# EAGLE design Front v1 (EAGLE 9.7.0)
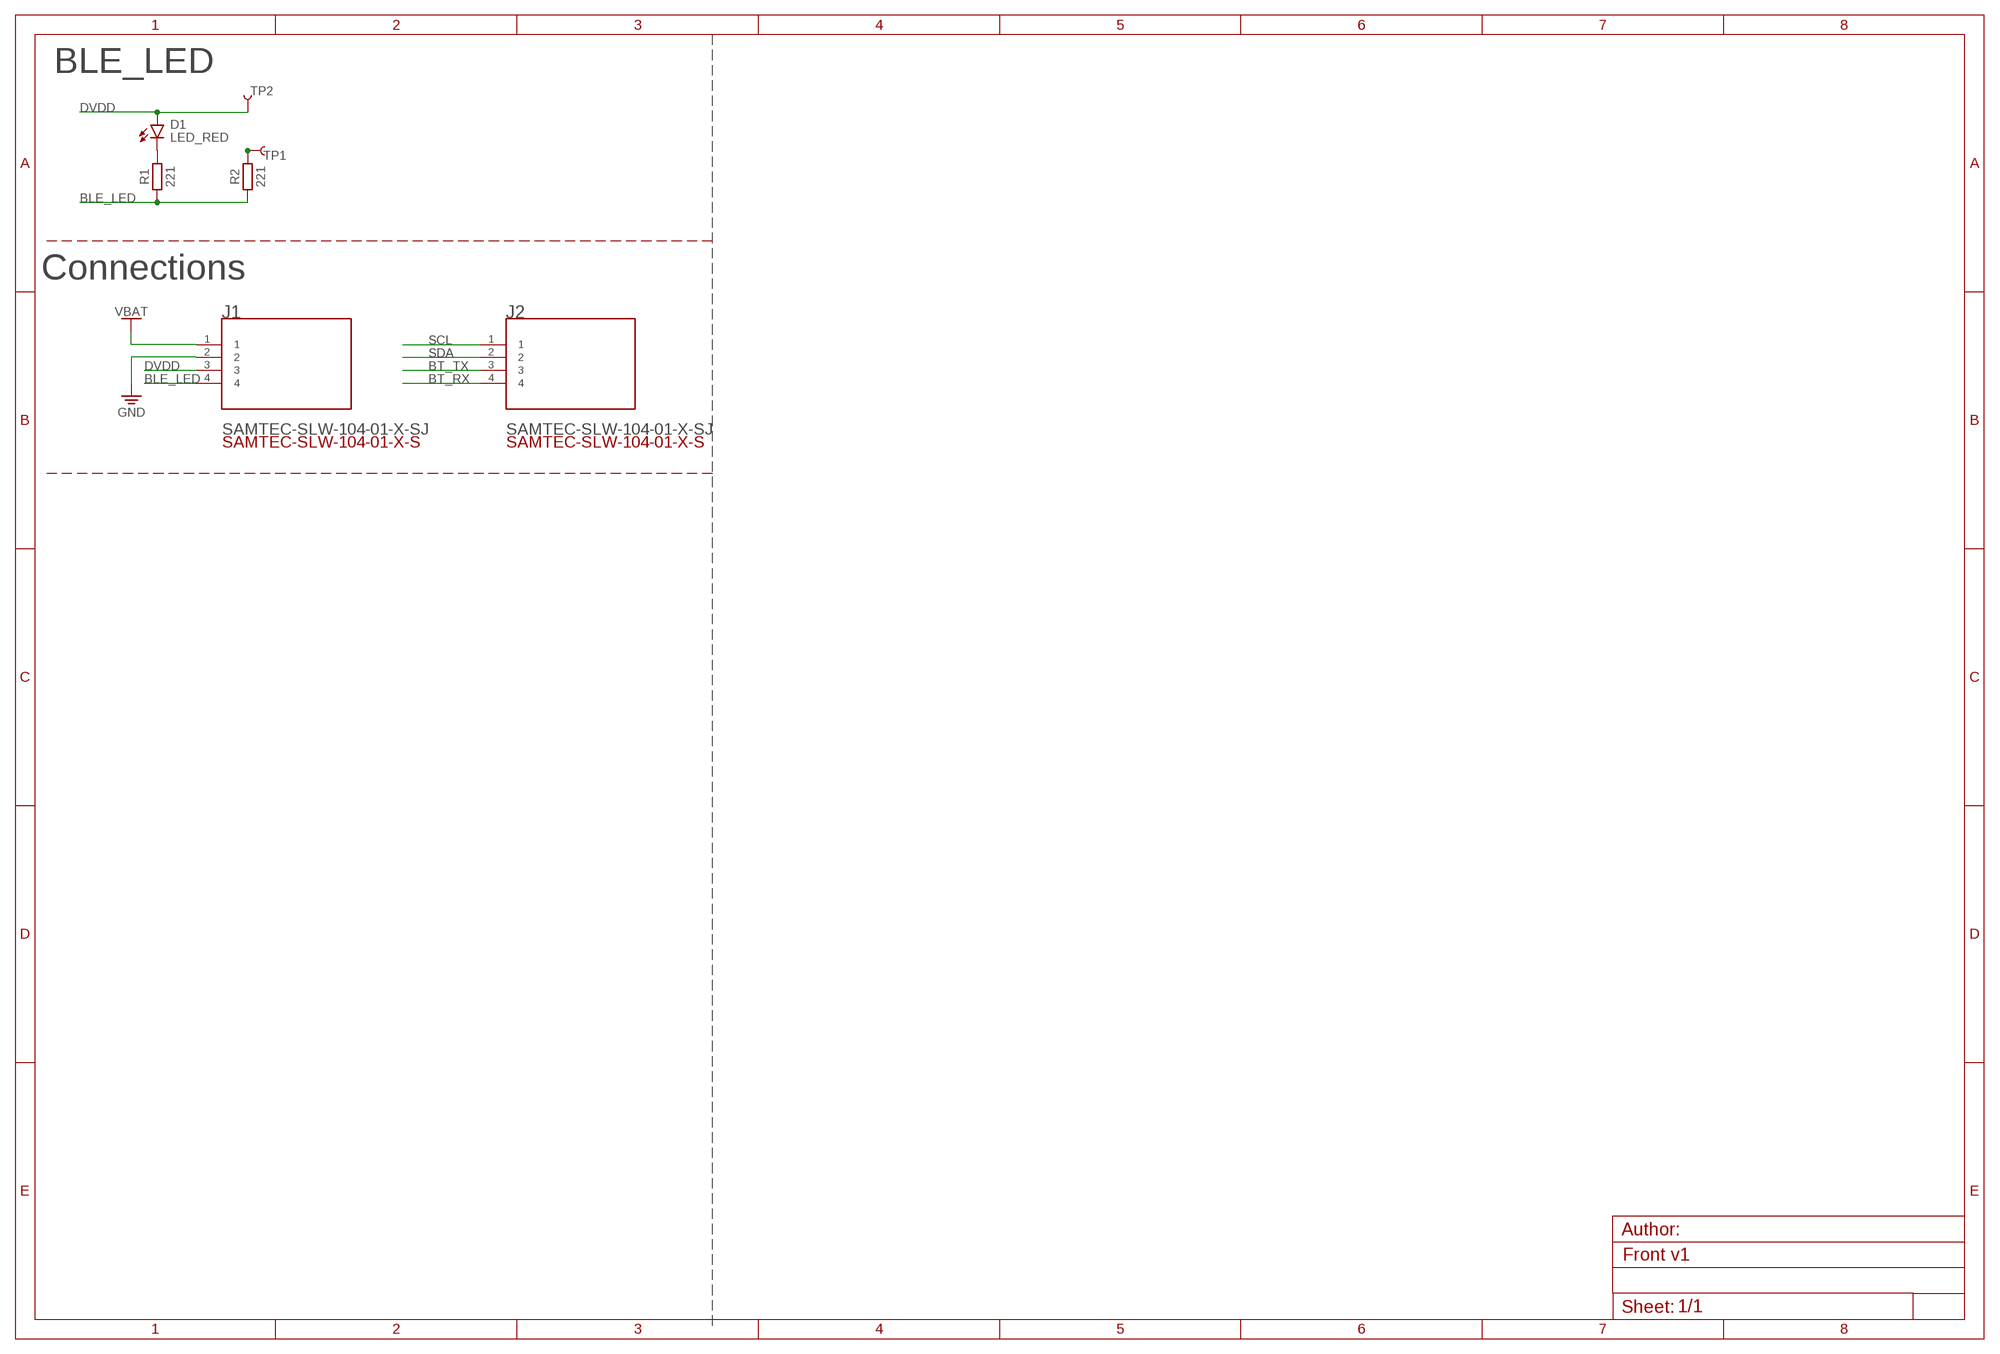
[diagram p0: schematic, sheet 1]

## Parts
D1  LED_RED  CHIP-ROUND-R_0603  [LEDC1608X65N_RND-R]
J1  SAMTEC-SLW-104-01-X-SJ  [SAMTEC-SLW-104-01-X-S]
J2  SAMTEC-SLW-104-01-X-SJ  [SAMTEC-SLW-104-01-X-S]
R1  221  R_CHIP-0603(1608-METRIC)  [RESC1608X60]
R2  221  R_CHIP-0603(1608-METRIC)  [RESC1608X60]
TP1  TEST-POINT3X5  [PAD.03X.05]
TP2  TEST-POINT3X5  [PAD.03X.05]

## Nets
BLE_LED: J1.4 R1.1 R2.1
BT_RX: J2.4
BT_TX: J2.3
DVDD: D1.A J1.3 TP2.P$1
GND: J1.2
N$1: R2.2 TP1.P$1
N$3: D1.C R1.2
SCL: J2.1
SDA: J2.2
VCC: J1.1 ; supply symbol labelled VBAT

## Notes on the sheet
- BLE_LED
- Connections

## Library data of the parts
D1 = LED:CHIP-ROUND-R: LED - Generic; CATEGORY: LED; COLOR: RED; DESCRIPTION: CHIP LED ROUND; SUB-CATEGORY: CHIP; TYPE: ROUND_TOP
J1 J2 = SAMTEC-SLW-104-01-X-S:SAMTEC-SLW-104-01-X-S
R1 R2 = Resistor:R: Resistor Fixed - Generic; CATEGORY: Resistor; SUB-CATEGORY: Fixed
TP1 TP2 = SparkFun-Connectors:TEST-POINT: SparkFun Test Points Bare copper test points for troubleshooting or In-Circuit-Testing. These are used by our Production team for verifying production board runs using pogo-pins on test beds. SparkFun Products: SparkFun LSM9DS1 Breakout <https://www.sparkfun.com/products/13284> SparkFun PSOC <https://www.sparkfun.com/products/13714> SparkFun Load Cell Amplifier <https://www.sparkfun.com/products/13879>

## Board
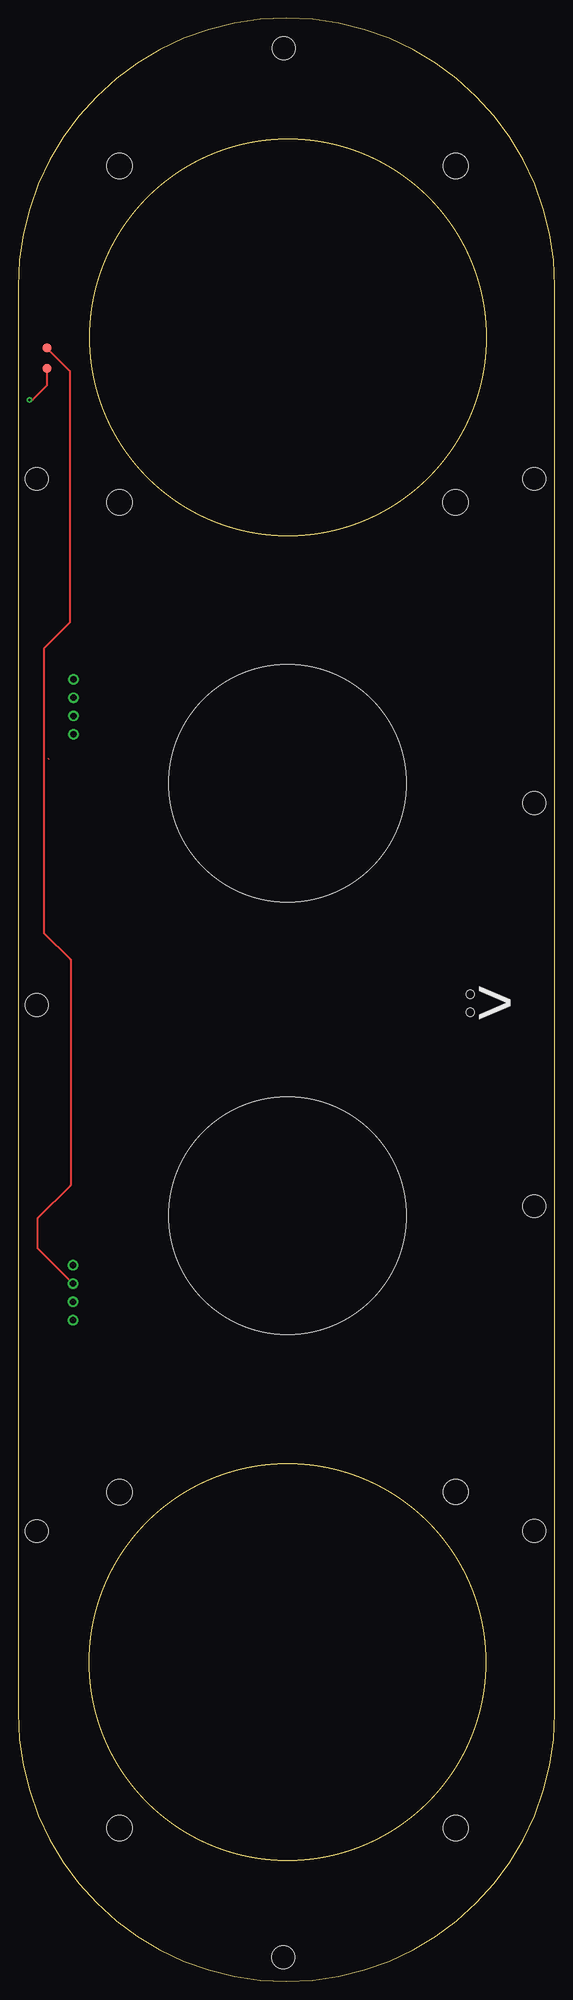
[diagram p1: board, top side]
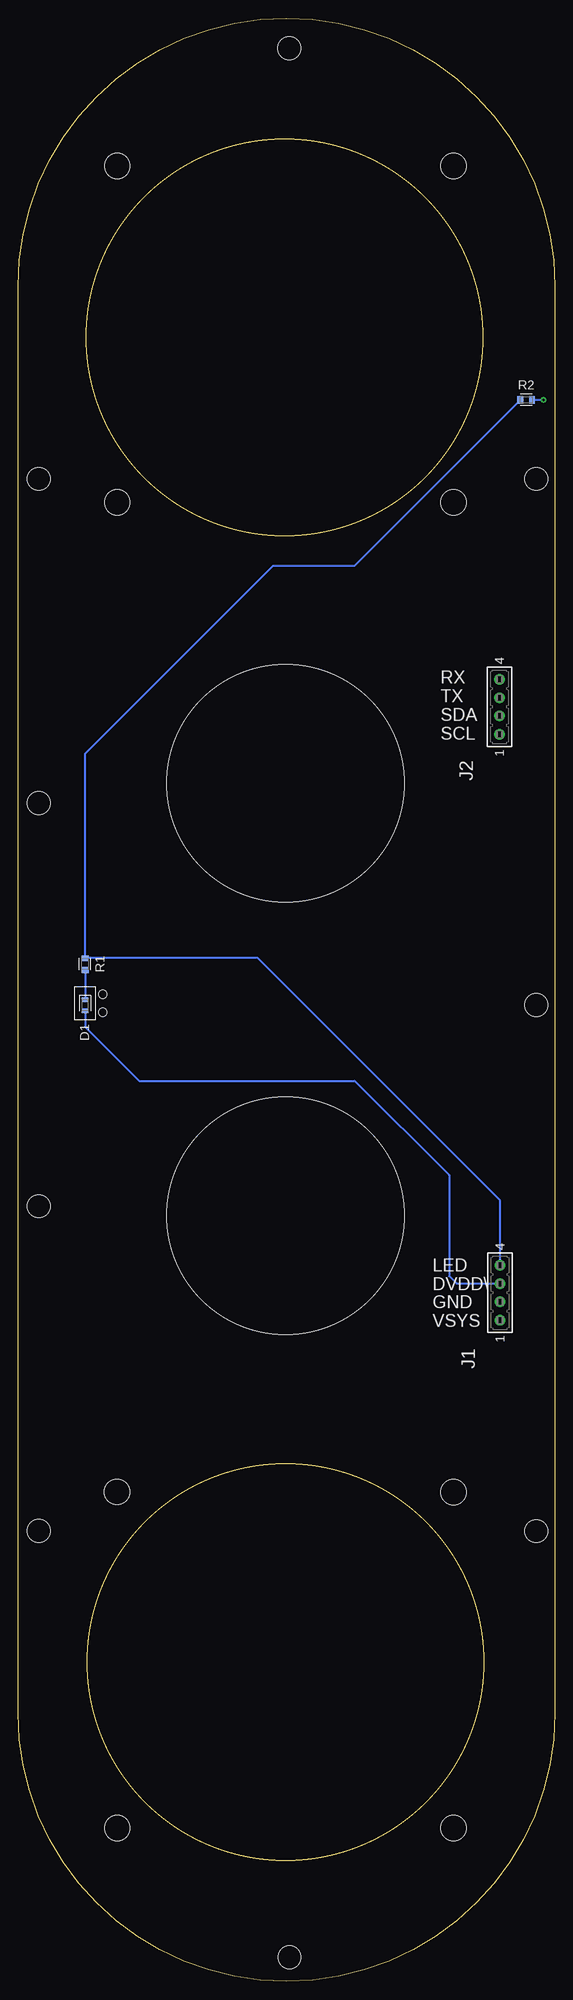
[diagram p2: board, bottom side, seen from below]

Size 74.5 x 272.5 mm. Coordinates in mm from the lower left corner, seen from the top.
Outline: 0,235.25 0,37.25 arc180 74.5,37.25 74.5,235.25 arc180 0,235.25
Outline: circle at 37.39,44.3 radius 27.5
Outline: circle at 37.49,228.2 radius 27.5
Copper layers (1*16): Top 0.035mm / dielectric 1.5mm / Bottom 0.035mm
Design rules "default": minimum track width 6mil, minimum drill 0.35mm, track to track 6mil, track to pad 6mil, pad to pad 6mil, via to via 6mil, smd to smd 6mil, copper to edge 40mil, drill to drill 6mil, minimum pad ring 10mil, minimum via ring 8mil, stop-mask expansion 4mil, vias tented up to drill 0mil, thermal gap 10mil
Holes 33 mm at 37.39,106.3 37.39,166.3
Holes 3.55 mm at 14.06,251.94 60.73,205.27 60.74,67.95 14.07,67.94 60.73,251.95 14.05,205.3 60.73,21.29 14.07,21.28
Holes 3.2 mm at 2.62,62.51 2.62,208.54 71.61,208.54 71.61,62.54 71.61,163.55 71.61,107.61 2.62,135.52 36.83,3.37 36.87,268.32

### Footprints (pad centres in the part's own frame; a part is rotated, then mirrored left to right if it is on the bottom)
LEDC1608X65N_RND-R = smd 0.612 x 0.912: A 0.75,0; C -0.75,0
SAMTEC-SLW-104-01-X-S = drill 0.86 pad 1.46: 1 -3.81,0; 2 -1.27,0; 3 1.27,0; 4 3.81,0
RESC1608X60 = smd 0.799 x 0.974: 1 -0.815,0; 2 0.815,0
PAD.03X.05 = smd 1.27 x 1.27: P$1 0,0
SLP3-150-300-F1 = hole 1.168: 1.23,2.54; -1.27,2.54

### Placement (x,y rotation side)
D1  65.2,135.5 270 bottom
J1  7.62,95.59 90 bottom
J2  7.7,176.9 90 bottom
R1  65.2,141.2 270 bottom
R2  4,219.5 0 bottom
TP1  4,223.9 0 top
TP2  4,226.7 0 top
U$1  SLP3-150-300-F  [SLP3-150-300-F1]  65.27,135.75 270 bottom

### Tracks (layer width: path | path; a pad name or v marks a point on that pad's centre or on a via)
BLE_LED
  Bottom 0.254: J1.4 7.62,108.42 41.22,142.01 R1.1 65.2,170.4 39.1,196.5 27.8,196.5 4.82,219.49 R2.1
DVDD
  Top 0.254: TP2.P$1 7.2,223.5 7.2,188.6 3.6,185 3.6,145.5 7.3,141.8 7.3,110.5 2.7,105.9 2.7,101.78 J1.3
  Bottom 0.254: D1.A 65.2,132.5 57.7,125 27.8,125 14.7,111.9 14.7,97.9 13.66,96.86 J1.3
N$1  (via drill 0.35)
  Top 0.254: TP1.P$1 4,221.5 2,219.5 v1.6,219.5
  Bottom 0.254: v1.6,219.5 R2.2
N$3
  Bottom 0.254: R1.2 D1.C
N$4
  Top 0.152: 4.3,169.6 4.2,169.7

### Text on the board
tNames: >
bNames: RX | TX | SDA | SCL | LED | DVDD\ | GND | VSYS